# EAGLE schematic ShopBot TinkerAccess (EAGLE 9.6.2)

## Sheet 1 of 3
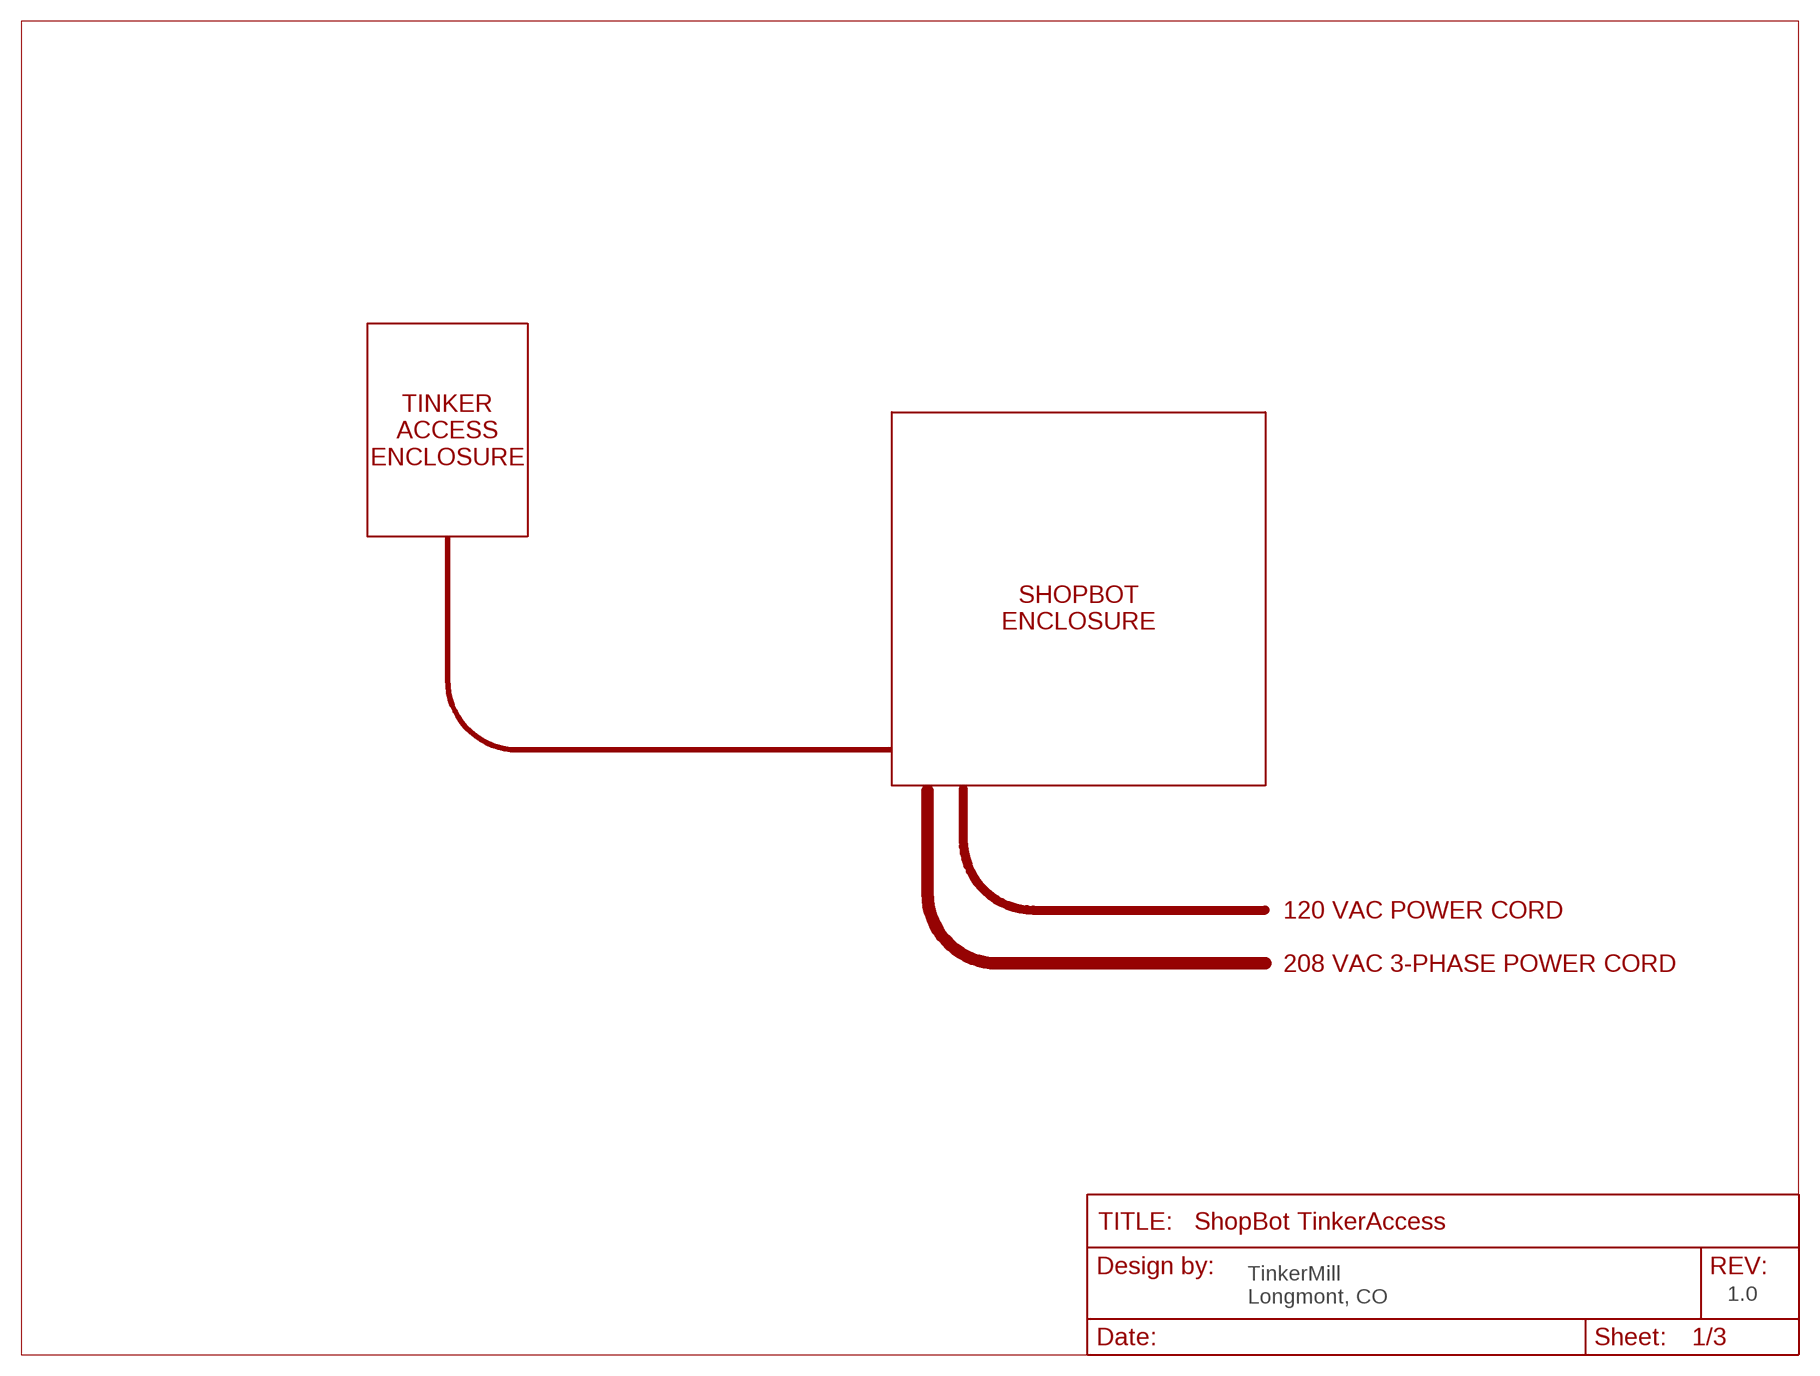
[diagram p0: schematic, sheet 1]

### Notes on the sheet
- TINKER
  ACCESS
  ENCLOSURE
- SHOPBOT
  ENCLOSURE
- 120 VAC POWER CORD
- 208 VAC 3-PHASE POWER CORD
- TinkerMill
  Longmont, CO
- 1.0

## Sheet 2 of 3
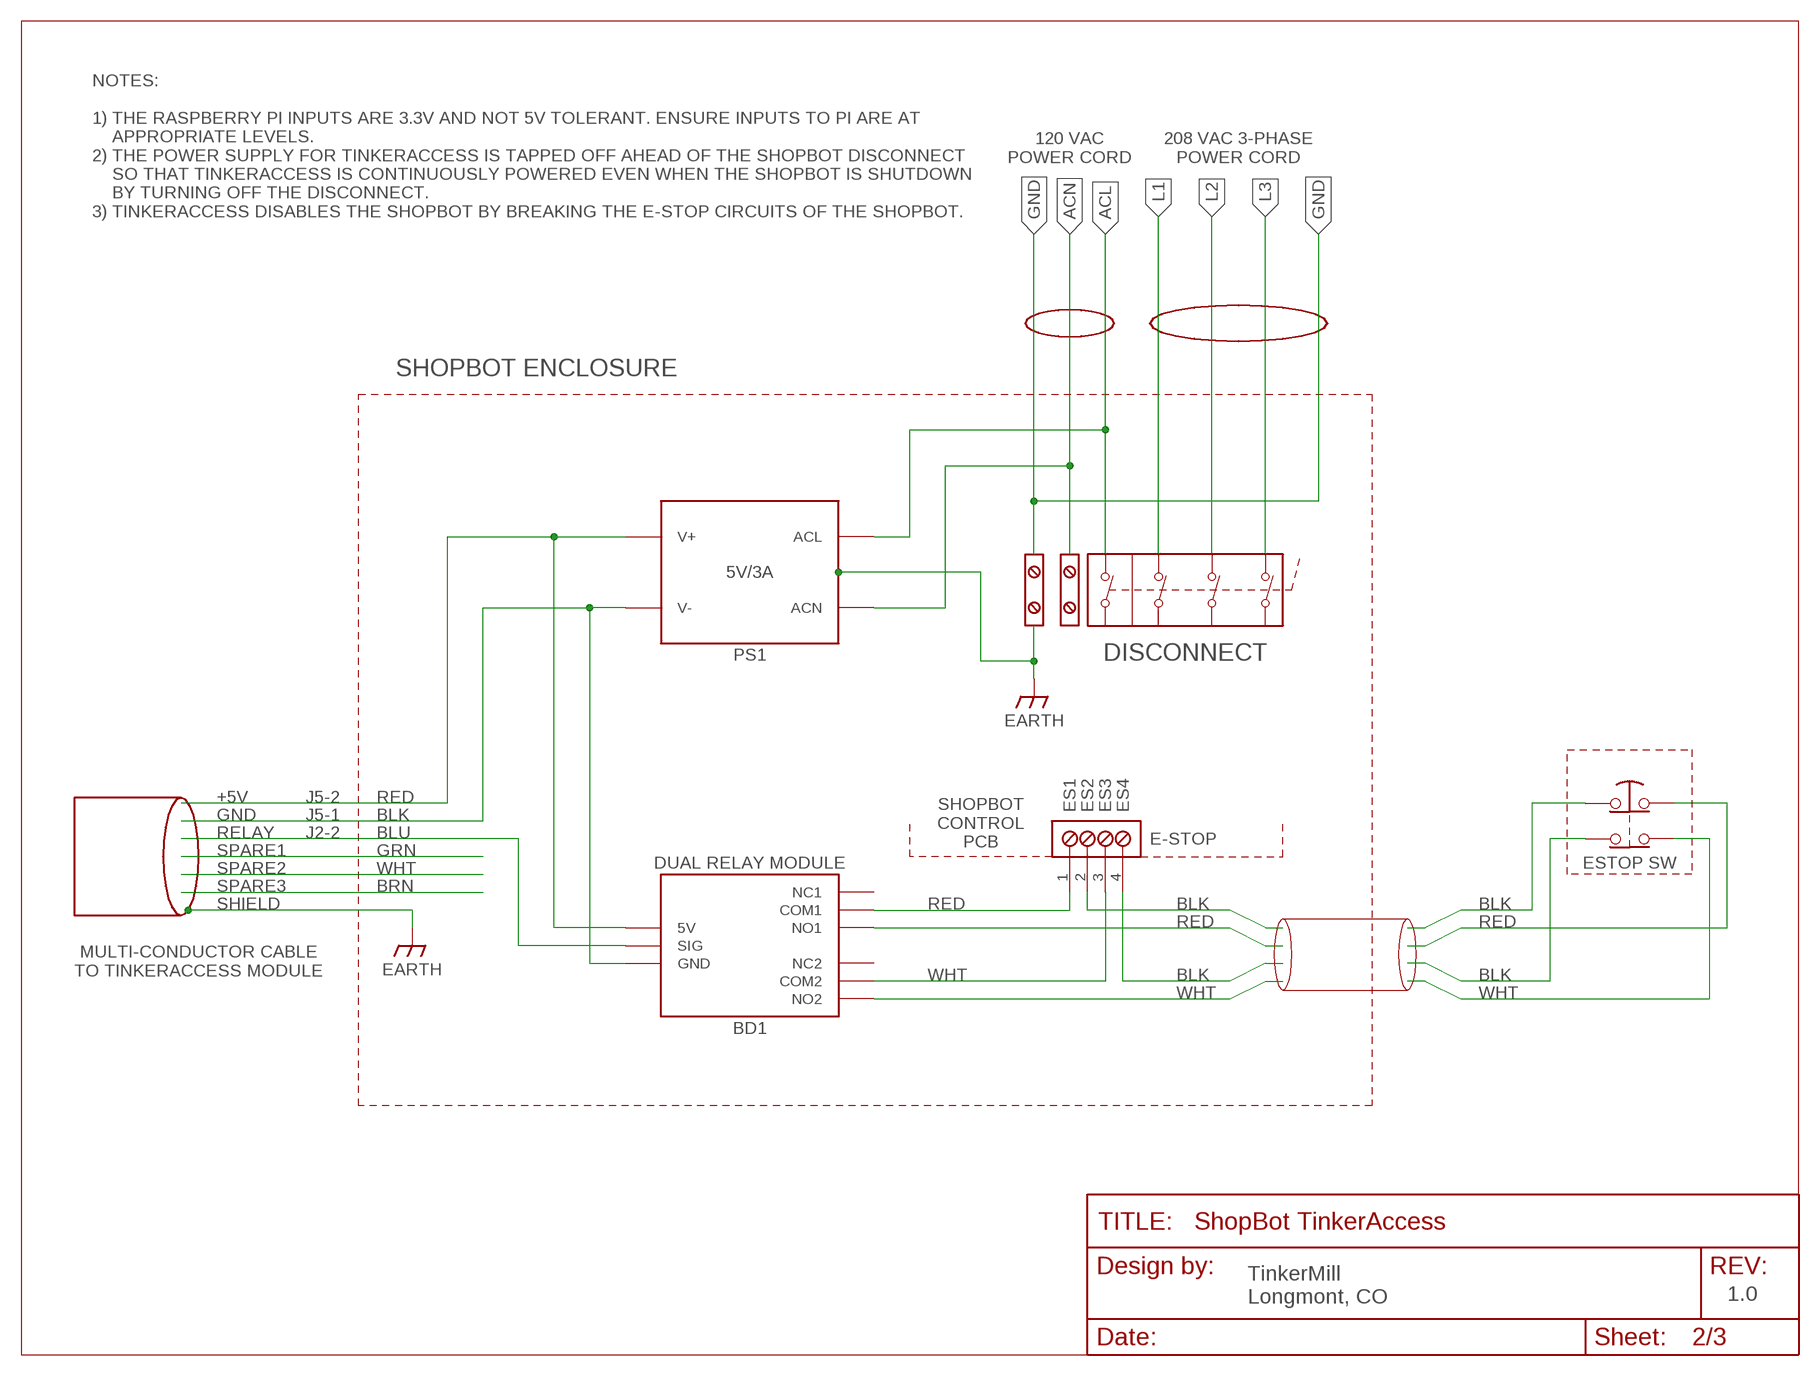
[diagram p1: schematic, sheet 2]

### Parts
BD1  DUAL RELAY MODULE  RELAY_MODULE_TM_DUAL  (no package)
ES1  ESTOP SW  ESTOP_SWITCH_DUAL  (no package)
J10  E-STOP  TB_4X1_TE_CONN_ED555_4DS  [TE_CONN_ED555_4DS]
PS1  5V/3A  POWER_SUPPLY  (no package)
SW1  DISCONNECT  DISCONNECT_4POLE  (no package)
TB1  TERMINAL_BLOCK  (no package)
TB2  TERMINAL_BLOCK  (no package)

### Nets
ACL: PS1.ACL SW1.L4
ACN: PS1.ACN TB1.B
BLK: BD1.GND PS1.V- ; also sheet 3
BLU: BD1.SIG ; also sheet 3
EARTH: TB2.A
ES1: BD1.COM1 J10.1
ES2: ES1.1
ES3: BD1.COM2 J10.3
ES4: ES1.3
ES_RED: ES1.2
ES_WHT: ES1.4
GND: TB2.B
L1: SW1.L1
L2: SW1.L2
L3: SW1.L3
N$1: J10.2
N$2: BD1.NO1
N$3: J10.4
N$4: BD1.NO2
RED: BD1.5V PS1.V+ ; also sheet 3
Unconnected: BD1.NC1 BD1.NC2 SW1.T1 SW1.T2 SW1.T3 SW1.T4 TB1.A

### Notes on the sheet
- NOTES:
  
  1) THE RASPBERRY PI INPUTS ARE 3.3V AND NOT 5V TOLERANT. ENSURE INPUTS TO PI ARE AT
      APPROPRIATE LEVELS.
  2) THE POWER SUPPLY FOR TINKERACCESS IS TAPPED OFF AHEAD OF THE SHOPBOT DISCONNECT
      SO THAT TINKERACCESS IS CONTINUOUSLY POWERED EVEN WHEN THE SHOPBOT IS SHUTDOWN
      BY TURNING OFF THE DISCONNECT.
  3) TINKERACCESS DISABLES THE SHOPBOT BY BREAKING THE E-STOP CIRCUITS OF THE SHOPBOT.
- 120 VAC
  POWER CORD
- 208 VAC 3-PHASE
  POWER CORD
- SHOPBOT ENCLOSURE
- DISCONNECT
- +5V | J5-2 | RED
- ES1 | ES2 | ES3 | ES4
- GND | J5-1 | BLK
- RELAY | J2-2 | BLU
- SHOPBOT
  CONTROL
  PCB
- SPARE1 | GRN
- SPARE2 | WHT
- SPARE3 | BRN
- SHIELD | RED | BLK | BLK
- RED | RED
- MULTI-CONDUCTOR CABLE
  TO TINKERACCESS MODULE
- WHT | BLK | BLK
- WHT | WHT
- TinkerMill
  Longmont, CO
- 1.0

## Sheet 3 of 3
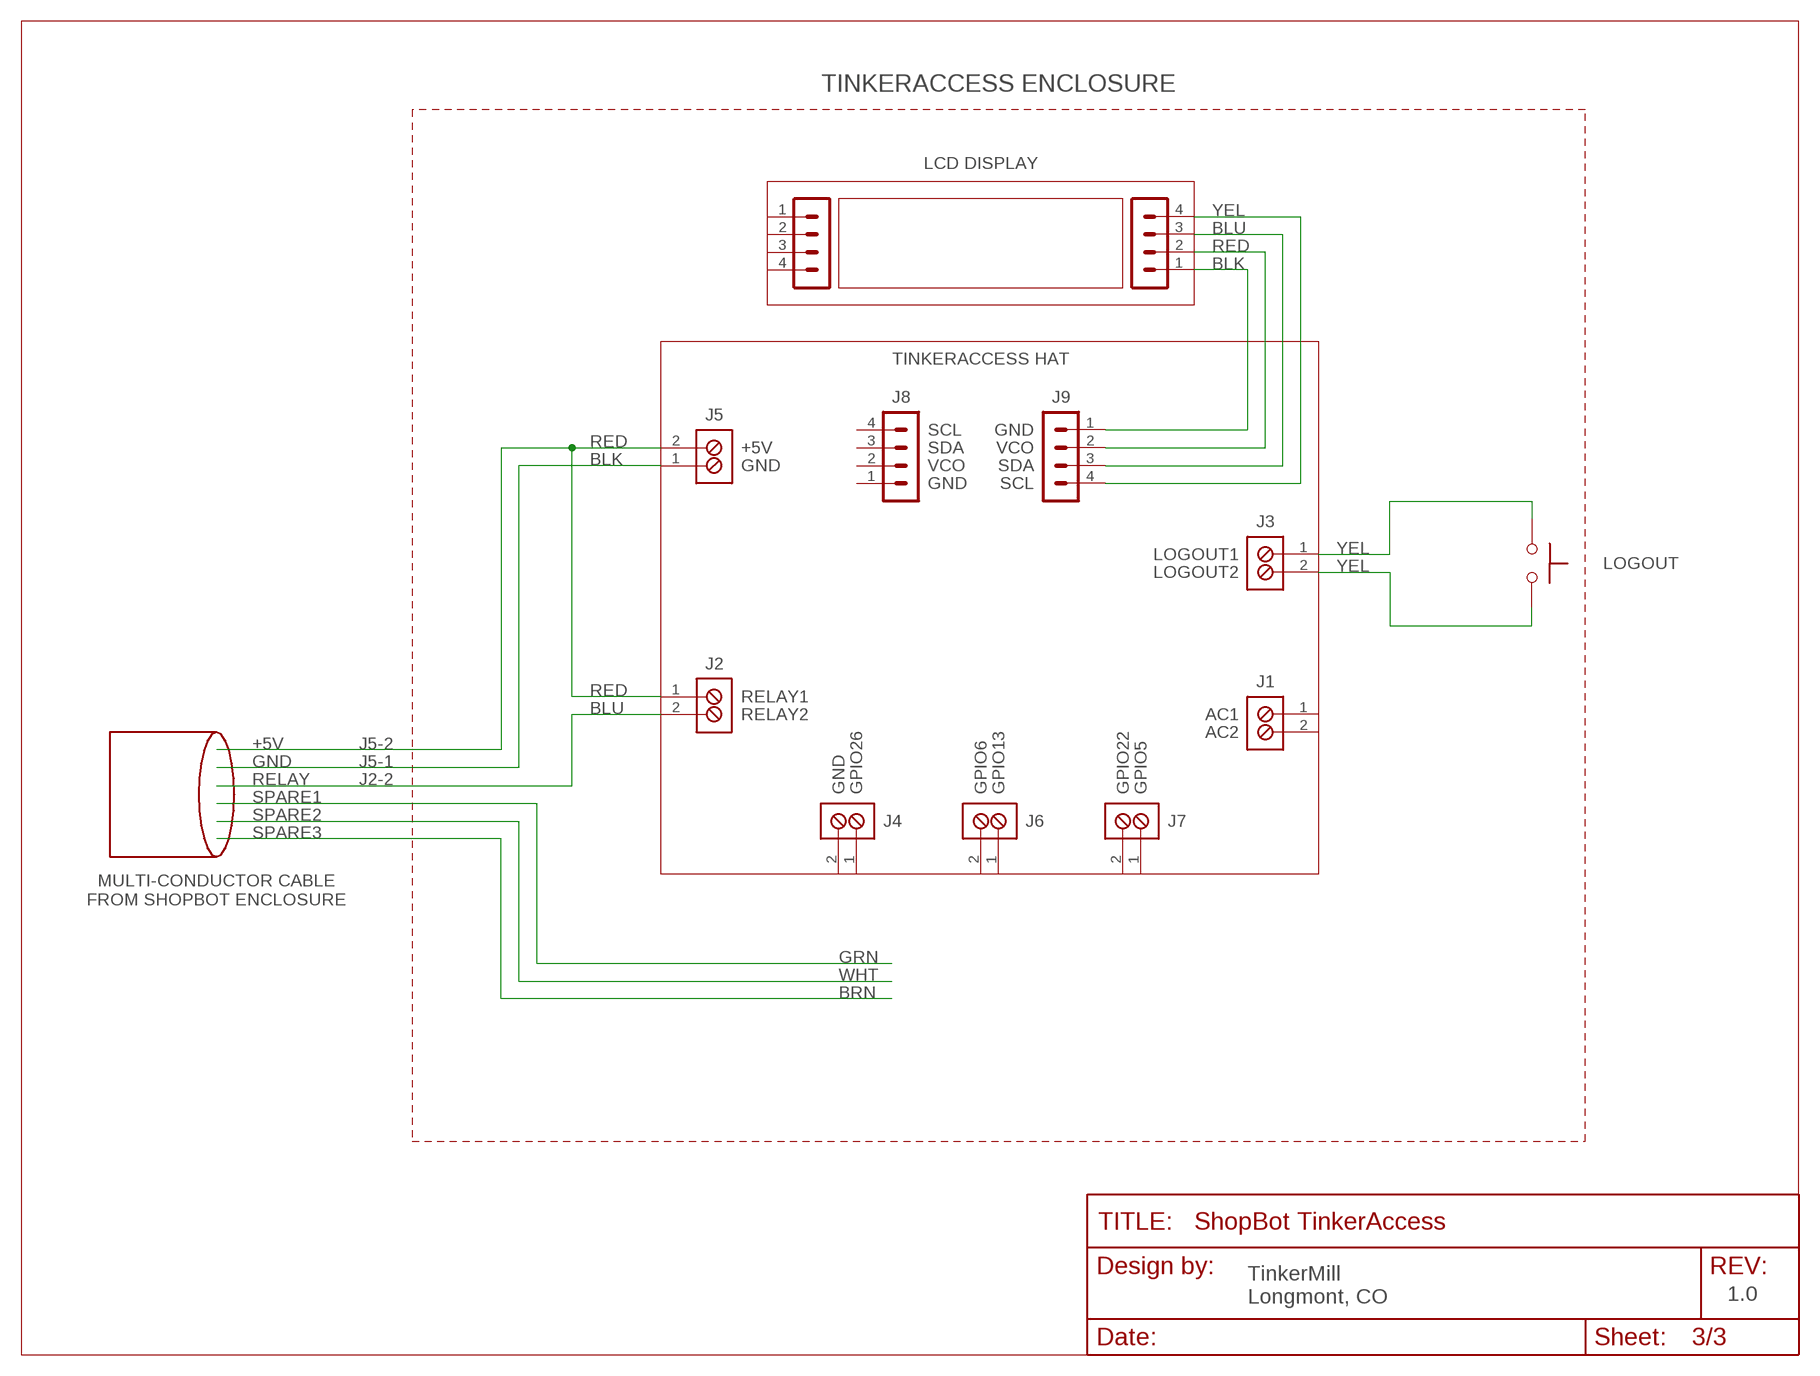
[diagram p2: schematic, sheet 3]

### Parts
J1  TB_2X1_TE_CONN_ED555_2DS  [TE_CONN_ED555_2DS]
J2  TB_2X1_TE_CONN_ED555_2DS  [TE_CONN_ED555_2DS]
J3  TB_2X1_TE_CONN_ED555_2DS  [TE_CONN_ED555_2DS]
J4  TB_2X1_TE_CONN_ED555_2DS  [TE_CONN_ED555_2DS]
J5  TB_2X1_TE_CONN_ED555_2DS  [TE_CONN_ED555_2DS]
J6  TB_2X1_TE_CONN_ED555_2DS  [TE_CONN_ED555_2DS]
J7  TB_2X1_TE_CONN_ED555_2DS  [TE_CONN_ED555_2DS]
J8  HDR_4X1_2.54MM_LOCKING_RA  [HDR_4X1_2.54MM_LOCKING_RA]
J9  HDR_4X1_2.54MM_LOCKING_RA  [HDR_4X1_2.54MM_LOCKING_RA]
J21  HDR_4X1_2.54MM_LOCKING_RA  [HDR_4X1_2.54MM_LOCKING_RA]
J22  HDR_4X1_2.54MM_LOCKING_RA  [HDR_4X1_2.54MM_LOCKING_RA]
SW3  LOGOUT  PUSHBUTTON_MOMENTARY_NO_OMRON_B3F_6MM  [OMRON_B3F_6MM]

### Nets
BLK: J5.1 ; also sheet 2
BLU: J2.2 ; also sheet 2
LCD-GND: J9.1 J22.1
LCD-SCL: J9.4 J22.4
LCD-SDA: J9.3 J22.3
LCD-VCO: J9.2 J22.2
LOGOUT1: J3.1 SW3.1 SW3.2
LOGOUT2: J3.2 SW3.3 SW3.4
RED: J2.1 J5.2 ; also sheet 2
Unconnected: J1.1 J1.2 J4.1 J4.2 J6.1 J6.2 J7.1 J7.2 J8.1 J8.2 J8.3 J8.4 J21.1 J21.2 J21.3 J21.4

### Notes on the sheet
- TINKERACCESS ENCLOSURE
- LCD DISPLAY
- YEL
- BLU
- RED
- BLK
- TINKERACCESS HAT
- SCL | GND
- RED | +5V | SDA | VCO
- BLK | GND | VCO | SDA
- GND | SCL
- LOGOUT1 | YEL
- LOGOUT2 | YEL
- RED | RELAY1
- BLU | RELAY2 | AC1
- AC2
- +5V | J5-2
- GND | J5-1
- RELAY | J2-2
- GND | GPIO26 | GPIO6 | GPIO13 | GPIO22 | GPIO5
- SPARE1
- SPARE2
- SPARE3
- MULTI-CONDUCTOR CABLE
  FROM SHOPBOT ENCLOSURE
- GRN
- WHT
- BRN
- TinkerMill
  Longmont, CO
- 1.0

## Library data of the parts
BD1 = TMF_Schematic_Only:RELAY_MODULE_TM_DUAL
ES1 = TMF_Schematic_Only:ESTOP_SWITCH_DUAL
J1-J7 = TMF_Connectors:TB_2X1
J8 J9 J21 J22 = TMF_Connectors:HDR_4X1
J10 = TMF_Connectors:TB_4X1
PS1 = TMF_Schematic_Only:POWER_SUPPLY
SW1 = TMF_Schematic_Only:DISCONNECT_4POLE
SW3 = TMF_Switches:PUSHBUTTON_MOMENTARY_NO
TB1 TB2 = TMF_Schematic_Only:TERMINAL_BLOCK